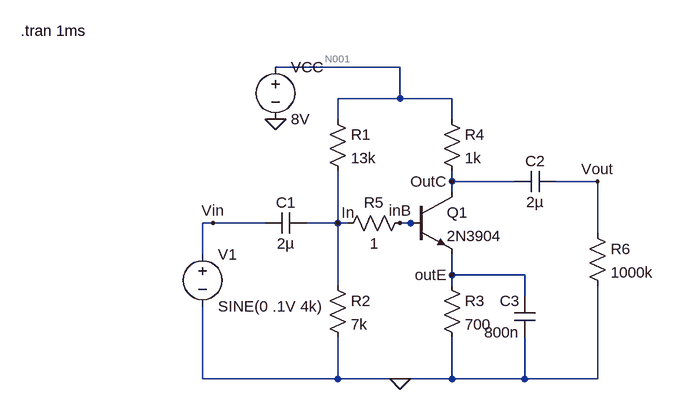
[diagram p0: schematic bjt-amplifier-03.asc]
bjt-amplifier-03.asc, the LTspice schematic file:
Version 4
SHEET 1 880 680
WIRE 32 -80 -160 -80
WIRE 32 -32 32 -80
WIRE 32 -32 -64 -32
WIRE 112 -32 32 -32
WIRE -64 0 -64 -32
WIRE 112 0 112 -32
WIRE 112 96 112 80
WIRE 208 96 112 96
WIRE 336 96 272 96
WIRE 112 112 112 96
WIRE -256 160 -272 160
WIRE -176 160 -256 160
WIRE -64 160 -64 80
WIRE -64 160 -112 160
WIRE -48 160 -64 160
WIRE 48 160 32 160
WIRE 64 160 48 160
WIRE 336 176 336 96
WIRE -272 208 -272 160
WIRE 112 240 112 208
WIRE 224 240 112 240
WIRE -64 256 -64 160
WIRE 112 256 112 240
WIRE 224 272 224 240
WIRE -272 400 -272 288
WIRE -64 400 -64 336
WIRE -64 400 -272 400
WIRE 32 400 -64 400
WIRE 112 400 112 336
WIRE 112 400 32 400
WIRE 224 400 224 336
WIRE 224 400 112 400
WIRE 336 400 336 256
WIRE 336 400 224 400
FLAG 32 400 0
FLAG 336 96 Vout
FLAG -256 160 Vin
FLAG -160 0 0
FLAG -64 160 In
FLAG 112 96 OutC
FLAG 112 240 outE
FLAG 32 160 inB
SYMBOL npn 48 112 R0
SYMATTR InstName Q1
SYMATTR Value 2N3904
SYMBOL res -80 -16 R0
SYMATTR InstName R1
SYMATTR Value 13k
SYMBOL res -80 240 R0
SYMATTR InstName R2
SYMATTR Value 7k
SYMBOL res 96 240 R0
SYMATTR InstName R3
SYMATTR Value 700
SYMBOL res 96 -16 R0
SYMATTR InstName R4
SYMATTR Value 1k
SYMBOL voltage -160 -96 R0
SYMATTR InstName VCC
SYMATTR Value 8V
SYMBOL cap -112 144 R90
WINDOW 0 0 32 VBottom 2
WINDOW 3 32 32 VTop 2
SYMATTR InstName C1
SYMATTR Value 2µ
SYMBOL cap 272 80 R90
WINDOW 0 0 32 VBottom 2
WINDOW 3 32 32 VTop 2
SYMATTR InstName C2
SYMATTR Value 2µ
SYMBOL voltage -272 192 R0
WINDOW 123 0 0 Left 0
WINDOW 39 0 0 Left 0
SYMATTR InstName V1
SYMATTR Value SINE(0 .1V 4k)
SYMBOL res 48 144 R90
WINDOW 0 0 56 VBottom 2
WINDOW 3 32 56 VTop 2
SYMATTR InstName R5
SYMATTR Value 1
SYMBOL res 320 160 R0
SYMATTR InstName R6
SYMATTR Value 1000k
SYMBOL cap 240 336 R180
WINDOW 0 24 56 Left 2
WINDOW 3 24 8 Left 2
SYMATTR InstName C3
SYMATTR Value 800n
TEXT -552 -136 Left 2 !.tran 1ms

The netlist it stands for:
* bjt-amplifier-03.asc
Q1 OutC inB outE 0 2N3904
R1 N001 In 13k
R2 In 0 7k
R3 outE 0 700
R4 N001 OutC 1k
VCC N001 0 8V
C1 In Vin 2µ
C2 Vout OutC 2µ
V1 Vin 0 SINE(0 .1V 4k)
R5 inB In 1
R6 Vout 0 1000k
C3 0 outE 800n
.model NPN NPN
.model PNP PNP
.lib standard.bjt
.tran 1ms
.backanno
.end

* Results of the author's LTspice run, read from the files saved beside the schematic
* Operating Point, zero values left out:
*   V(outc) = 5.049 V
*   V(inb) = 2.756 V
*   V(oute) = 2.073 V
*   V(n001) = 8 V
*   V(in) = 2.756 V
*   Ic(Q1) = 2.951 mA
*   Ib(Q1) = 9.686 µA
*   Ie(Q1) = -2.961 mA
*   I(R1) = 403.4 µA
*   I(R2) = 393.7 µA
*   I(R3) = 2.961 mA
*   I(R4) = 2.951 mA
*   I(R5) = -9.686 µA
*   I(Vcc) = -3.355 mA
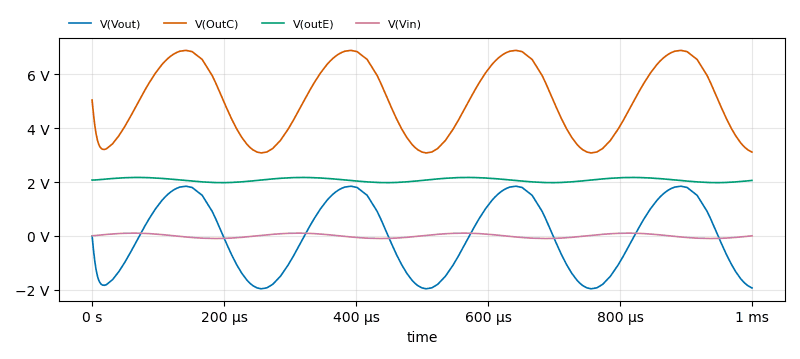
[diagram p1: Transient Analysis of bjt-amplifier-03.asc, plotted from the saved traces]
* Transient Analysis, 1 run:
*   V(Vout): min -1.968 V, max 1.844 V, average 5.157 mV, rms 1.352 V, last -1.936 V
*   V(OutC): min 3.08 V, max 6.893 V, average 5.054 V, rms 5.232 V, last 3.113 V
*   V(outE): min 1.976 V, max 2.17 V, average 2.076 V, rms 2.077 V, last 2.059 V
*   V(Vin): min -100 mV, max 100 mV, average 60.97 µV, rms 70.63 mV, last 0 V